# Altium project JlinkV9.PrjPcb
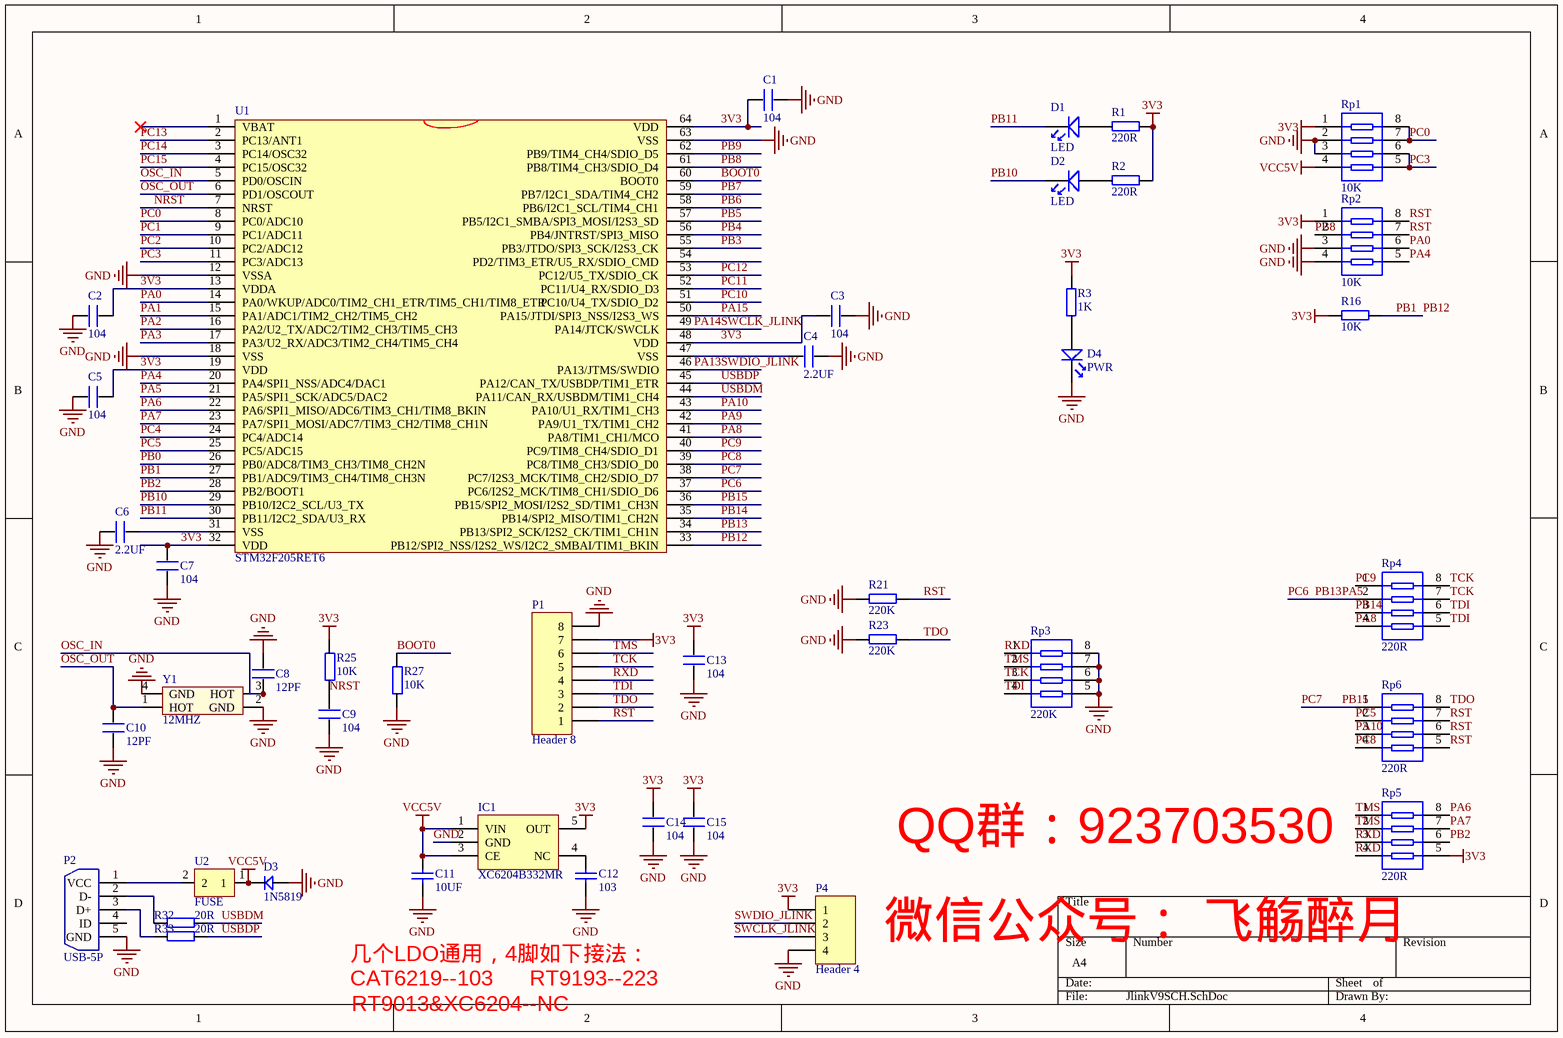
[diagram p0: JlinkV9SCH.SchDoc]
1 sheet, 42 parts. Net scope: global (net labels, ports and power ports of the same name join across sheets).
Board file: JlinkV9PCB.PcbDoc

## Sheet JlinkV9SCH.SchDoc
size A4

### Parts
C1  104  [0402_C]
C2  104  [0402_C]
C3  104  [0402_C]
C4  2.2UF  [0402_C]
C5  104  [0402_C]
C6  2.2UF  [0402_C]
C7  104  [0402_C]
C8  12PF  [0402_C]
C9  104  [0402_C]
C10  12PF  [0402_C]
C11  10UF  [0603_C]
C12  103  [0402_C]
C13  104  [0603_C]
C14  104  [0603_C]
C15  104  [0603_C]
D1  LED  [SMDLED-0603]
D2  LED  [SMDLED-0603]
D3  1N5819  [SOD-323]
D4  PWR  [SMDLED-0603]
IC1  XC6204B332MR  [SOT23-5L]
P1  Header 8  [GH1.25-8P]
P2  USB-5P  [MICRO_USB]
P4  Header 4  [HDR1X4_SMD]
R1  220R  [0402_R]
R2  220R  [0402_R]
R3  1K  [0402_R]
R16  10K  [0402_R]
R21  220K  [0402_R]
R23  220K  [0402_R]
R25  10K  [0402_R]
R27  10K  [0402_R]
R32  20R  [0402_R]
R33  20R  [0402_R]
Rp1  10K  [0402_Rx4]
Rp2  10K  [0402_Rx4]
Rp3  220K  [0402_Rx4]
Rp4  220R  [0402_Rx4]
Rp5  220R  [0402_Rx4]
Rp6  220R  [0402_Rx4]
U1  STM32F205RET6  [STM-LQFP64_M]
U2  FUSE  [0603P]
Y1  12MHZ  [XTAL3225]

### Nets
3V3: C1.2 C2.1 C3.2 C5.1 C7.2 C13.2 C14.2 C15.2 IC1.5(OUT) P1.7 P4.1 R1.1 R2.1 R3.1 R16.2 R25.2 Rp1.1 Rp2.1 Rp5.5 U1.13(VDDA) U1.19(VDD) U1.32(VDD) U1.48(VDD) U1.64(VDD)
GND: C1.1 C2.2 C3.1 C4.2 C5.2 C6.2 C7.1 C8.2 C9.1 C10.1 C11.1 C12.1 C13.1 C14.1 C15.1 D3.1 D4.2 IC1.2(GND) P1.8 P2.5(GND) P4.4 R21.2 R23.2 R27.1 Rp1.2 Rp1.3 Rp2.3 Rp2.4 Rp3.5 Rp3.6 Rp3.7 Rp3.8 U1.12(VSSA) U1.18(VSS) U1.63(VSS) Y1.2(GND) Y1.4(GND)
VCC5V: C11.2 D3.2 IC1.1(VIN) IC1.3(CE) Rp1.4 U2.1
BOOT0: R27.2 U1.60(BOOT0)
NRST: C9.2 R25.1 U1.7(NRST)
OSC_IN: C8.1 U1.5(PD0/OSCIN) Y1.3(HOT)
OSC_OUT: C10.2 U1.6(PD1/OSCOUT) Y1.1(HOT)
PA0: Rp2.6 U1.14(PA0/WKUP/ADC0/TIM2_CH1_ETR/TIM5_CH1/TIM8_ETR)
PA1: U1.15(PA1/ADC1/TIM2_CH2/TIM5_CH2)
PA2: U1.16(PA2/U2_TX/ADC2/TIM2_CH3/TIM5_CH3)
PA3: U1.17(PA3/U2_RX/ADC3/TIM2_CH4/TIM5_CH4)
PA4: Rp2.5 U1.20(PA4/SPI1_NSS/ADC4/DAC1)
PA5: Rp4.2 U1.21(PA5/SPI1_SCK/ADC5/DAC2) U1.34(PB13/SPI2_SCK/I2S2_CK/TIM1_CH1N) U1.37(PC6/I2S2_MCK/TIM8_CH1/SDIO_D6)  [also labelled PB13, PC6]
PA6: Rp5.8 U1.22(PA6/SPI1_MISO/ADC6/TIM3_CH1/TIM8_BKIN)
PA7: Rp5.7 U1.23(PA7/SPI1_MOSI/ADC7/TIM3_CH2/TIM8_CH1N)
PA8: Rp4.4 U1.41(PA8/TIM1_CH1/MCO)
PA9: U1.42(PA9/U1_TX/TIM1_CH2)
PA10: Rp6.3 U1.43(PA10/U1_RX/TIM1_CH3)
PA13: P4.2 U1.46(PA13/JTMS/SWDIO)  [also labelled SWDIO_JLINK]
PA14: P4.3 U1.49(PA14/JTCK/SWCLK)  [also labelled SWCLK_JLINK]
PA15: U1.50(PA15/JTDI/SPI3_NSS/I2S3_WS)
PB0: U1.26(PB0/ADC8/TIM3_CH3/TIM8_CH2N)
PB1: R16.1 U1.27(PB1/ADC9/TIM3_CH4/TIM8_CH3N) U1.33(PB12/SPI2_NSS/I2S2_WS/I2C2_SMBAI/TIM1_BKIN)  [also labelled PB12]
PB2: Rp5.6 U1.28(PB2/BOOT1)
PB3: U1.55(PB3/JTDO/SPI3_SCK/I2S3_CK)
PB4: U1.56(PB4/JNTRST/SPI3_MISO)
PB5: U1.57(PB5/I2C1_SMBA/SPI3_MOSI/I2S3_SD)
PB6: U1.58(PB6/I2C1_SCL/TIM4_CH1)
PB7: U1.59(PB7/I2C1_SDA/TIM4_CH2)
PB8: Rp2.2 U1.61(PB8/TIM4_CH3/SDIO_D4)
PB9: U1.62(PB9/TIM4_CH4/SDIO_D5)
PB10: D2.2 U1.29(PB10/I2C2_SCL/U3_TX)
PB11: D1.2 U1.30(PB11/I2C2_SDA/U3_RX)
PB14: Rp4.3 U1.35(PB14/SPI2_MISO/TIM1_CH2N)
PB15: Rp6.1 U1.36(PB15/SPI2_MOSI/I2S2_SD/TIM1_CH3N) U1.38(PC7/I2S3_MCK/TIM8_CH2/SDIO_D7)  [also labelled PC7]
PC0: Rp1.7 Rp1.8 U1.8(PC0/ADC10)
PC1: U1.9(PC1/ADC11)
PC2: U1.10(PC2/ADC12)
PC3: Rp1.5 Rp1.6 U1.11(PC3/ADC13)
PC4: U1.24(PC4/ADC14)
PC5: Rp6.2 U1.25(PC5/ADC15)
PC8: Rp6.4 U1.39(PC8/TIM8_CH3/SDIO_D0)
PC9: Rp4.1 U1.40(PC9/TIM8_CH4/SDIO_D1)
PC10: U1.51(PC10/U4_TX/SDIO_D2)
PC11: U1.52(PC11/U4_RX/SDIO_D3)
PC12: U1.53(PC12/U5_TX/SDIO_CK)
PC13: U1.2(PC13/ANT1)
PC14: U1.3(PC14/OSC32)
PC15: U1.4(PC15/OSC32)
RST: P1.1 R21.1 Rp2.7 Rp2.8 Rp6.5 Rp6.6 Rp6.7
RXD: P1.4 Rp3.1 Rp5.3 Rp5.4
TCK: P1.5 Rp3.3 Rp4.7 Rp4.8
TDI: P1.3 Rp3.4 Rp4.5 Rp4.6
TDO: P1.2 R23.1 Rp6.8
TMS: P1.6 Rp3.2 Rp5.1 Rp5.2
USBDM: R32.1 U1.44(PA11/CAN_RX/USBDM/TIM1_CH4)
USBDP: R33.1 U1.45(PA12/CAN_TX/USBDP/TIM1_ETR)
NetC4_1: C4.1 U1.47(VSS)
NetC6_1: C6.1 U1.31(VSS)
NetC12_2: C12.2 IC1.4(NC)
NetD1_1: D1.1 R1.2
NetD2_1: D2.1 R2.2
NetD4_1: D4.1 R3.2
NetP2_1: P2.1(VCC) U2.2
NetP2_2: P2.2(D-) R32.2
NetP2_3: P2.3(D+) R33.2

Not connected (* = marked no-connect by the designer): P2 4(ID); U1 1(VBAT)* 54(PD2/TIM3_ETR/U5_RX/SDIO_CMD)

### Notes on the sheet
- QQ群：923703530
- CAT6219--103
- 几个LDO通用，4脚如下接法：
- RT9193--223
- 微信公众号： 飞觞醉月
- RT9013&XC6204--NC

### Library data of the parts
C1-C10 C13-C15 = C
C11 = 0603 10uF (106) 10% 10V: 贴片电容; ComponentLink1Description: 供应商链接; ComponentLink1URL: http://www.szlcsc.com/product/details_20411.html; Package: 0603; Supplier: LC; SuppliersPartNumber: C19702
C12 = 0402 10nF (103) 10% 50V: 贴片电容; ComponentLink1Description: 供应商链接; ComponentLink1URL: http://www.szlcsc.com/product/details_15869.html; Package: 0402; Supplier: LC; SuppliersPartNumber: C15195
D3 = D
D4 = LED
IC1 = LDO XC6204: LDO; BOM名称: 稳压芯片; 版权归属: 源创客; 学习资源: www.ooocke.com
P1 = Header 8: Header, 8-Pin; LatestRevisionDate: 17-Jul-2002; LatestRevisionNote: Re-released for DXP Platform.; Publisher: Altium Limited
P2 = USB-5P: 微型USB母座; 版权归属: 源创客; BOM名称: 微型USB母座; 学习资源: www.ooocke.com
P4 = Header 4: Header, 4-Pin; LatestRevisionDate: 17-Jul-2002; LatestRevisionNote: Re-released for DXP Platform.; Publisher: Altium Limited
R1-R3 R16 R21 R23 R25 R27 R32 R33 = R
Rp1-Rp6 = R*4: 贴片排阻; Package: 0603*4
U1 = STM32F103RET6
Y1 = XTAL_3225: 3225贴片无源晶振